# Altium schematic sheet source.SchDoc
size A4
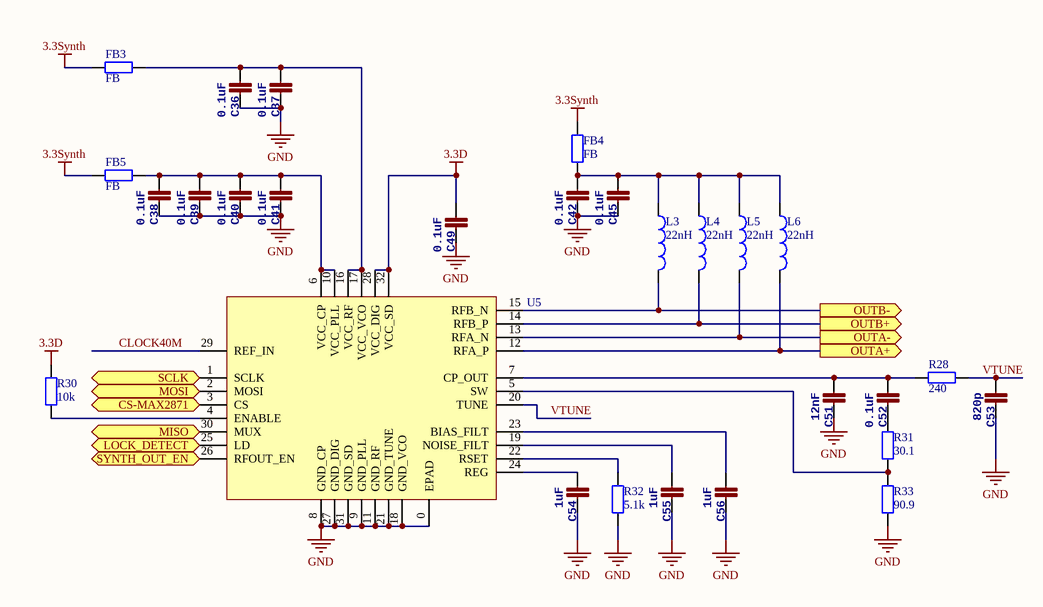
[diagram p0: source.SchDoc]

## Parts
C36  0.1uF  [0402]
C37  0.1uF  [0402]
C38  0.1uF  [0402]
C39  0.1uF  [0402]
C40  0.1uF  [0402]
C41  0.1uF  [0402]
C42  0.1uF  [0402]
C45  0.1uF  [0402]
C49  0.1uF  [0402]
C51  12nF  [0402]
C52  0.1uF  [0402]
C53  820p  [0402]
C54  1uF  [0402]
C55  1uF  [0402]
C56  1uF  [0402]
FB3  FB  [0603]
FB4  FB  [0603]
FB5  FB  [0603]
L3  value 22nH  [0402]  (hidden comment: Inductor)
L4  value 22nH  [0402]  (hidden comment: Inductor)
L5  value 22nH  [0402]  (hidden comment: Inductor)
L6  value 22nH  [0402]  (hidden comment: Inductor)
R28  240  [0402]
R30  10k  [0402]
R31  30.1  [0402]
R32  5.1k  [0402]
R33  90.9  [0402]
U5  MAX2871  [MAX2871]  (value not drawn)

## Ports
CS-MAX2871 (in), LOCK_DETECT, MISO, MOSI, OUTA+ (out), OUTA- (out), OUTB+ (out), OUTB- (out), SCLK (in), SYNTH_OUT_EN

## Nets
3.3D: C49.1 R30.2 U5.28(VCC_DIG) U5.32(VCC_SD)
3.3Synth: FB3.2 FB4.1 FB5.2
GND: C36.2 C37.2 C38.2 C39.2 C40.2 C41.2 C42.2 C45.2 C49.2 C51.2 C53.2 C54.2 C55.2 C56.2 R32.1 R33.1 U5.0(EPAD) U5.8(GND_CP) U5.9(GND_PLL) U5.11(GND_RF) U5.18(GND_VCO) U5.21(GND_TUNE) U5.27(GND_DIG) U5.31(GND_SD)
CLOCK40M: U5.29(REF_IN)
CS-MAX2871: U5.3(CS) ; port CS-MAX2871
LOCK_DETECT: U5.25(LD) ; port LOCK_DETECT
MISO: U5.30(MUX) ; port MISO
MOSI: U5.2(MOSI) ; port MOSI
OUTA+: L6.2 U5.12(RFA_P) ; port OUTA+
OUTA-: L5.2 U5.13(RFA_N) ; port OUTA-
OUTB+: L4.2 U5.14(RFB_P) ; port OUTB+
OUTB-: L3.2 U5.15(RFB_N) ; port OUTB-
SCLK: U5.1(SCLK) ; port SCLK
SYNTH_OUT_EN: U5.26(RFOUT_EN) ; port SYNTH_OUT_EN
VTUNE: C53.1 R28.1 U5.20(TUNE)
NetC36_1: C36.1 C37.1 FB3.1 U5.16(VCC_RF) U5.17(VCC_VCO)
NetC38_1: C38.1 C39.1 C40.1 C41.1 FB5.1 U5.6(VCC_CP) U5.10(VCC_PLL)
NetC42_1: C42.1 C45.1 FB4.2 L3.1 L4.1 L5.1 L6.1
NetC51_1: C51.1 C52.1 R28.2 U5.7(CP_OUT)
NetC52_2: C52.2 R31.2
NetC54_1: C54.1 U5.24(REG)
NetC55_1: C55.1 U5.19(NOISE_FILT)
NetC56_1: C56.1 U5.23(BIAS_FILT)
NetR30_1: R30.1 U5.4(ENABLE)
NetR31_1: R31.1 R33.2 U5.5(SW)
NetR32_2: R32.2 U5.22(RSET)

## Library data of the parts
C36-C42 C45 C49 C51-C56 = CAP0402-CAP: <b>Capacitor</b> / Standard 0603 ceramic capacitor, and 0.1" leaded capacitor.; PARTNO: CC0402ZRY5V7BB104
FB3-FB5 R28 R30-R33 = Res2: Resistor; Published: 8-Jun-2000; LatestRevisionDate: 17-Jul-2002; LatestRevisionNote: Re-released for DXP Platform.; PackageReference: AXIAL-0.4; Publisher: Altium Limited; PackageDescription: Axial Device, Thru-Hole; 2 Leads; 0.4 in Pin Spacing
L3-L6 = Inductor: Code_IEC: 1005; Published: 8-Jun-2000; LatestRevisionDate: 29-May-2009; LatestRevisionNote: IPC-7351 Footprint Added.; PackageReference: 0402-A; Publisher: Altium Limited; PackageDescription: Chip Inductor; Code_JEITA: 0402